# EAGLE design config (EAGLE 6.6.0)
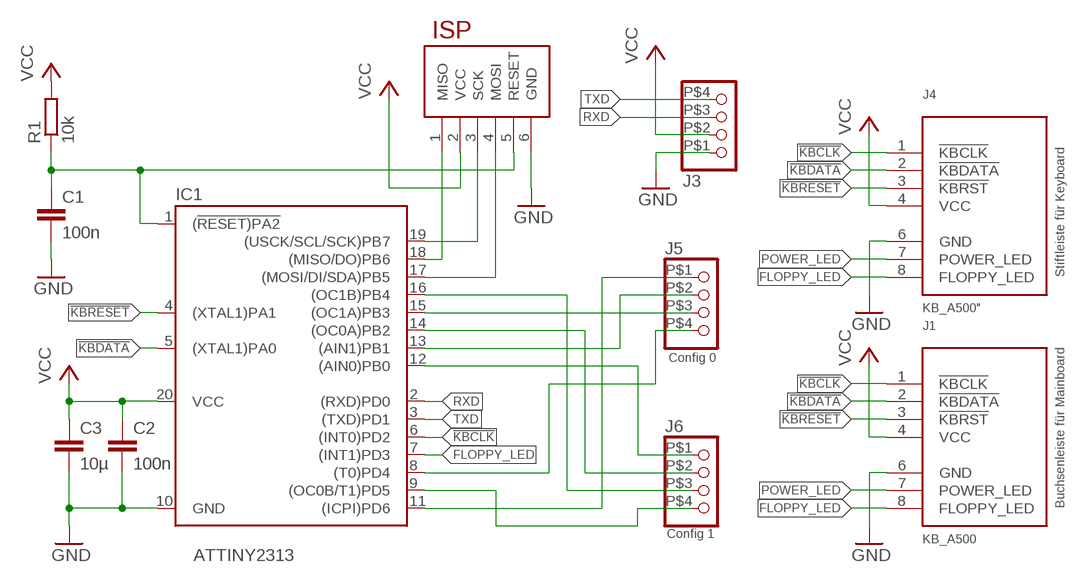
[diagram p0: schematic, sheet 1]

## Parts
C1  100n  C-EUC0805  [C0805]
C2  100n  C-EUC0805  [C0805]
C3  10µ  C-EUC1206  [C1206]
IC1  ATTINY2313  [SO20L]
J1  KB_A500  [1X08S]
J2  ISP  ISP6STEHEND  [2X03]
J3  PINHD-1X4  [1X04SLIM]
J4  KB_A500"  [1X08/90SLIM]
J5  PINHD-1X4  [1X04SLIM]
J6  PINHD-1X4  [1X04SLIM]
R1  10k  R-EU_R0805  [R0805]

## Nets
!KBCLK: IC1.6((INT0)PD2) J1.1(!KBCLK) J4.1(!KBCLK)
!KBDATA: IC1.5((XTAL1)PA0) J1.2(!KBDATA) J4.2(!KBDATA)
!KBRESET: IC1.4((XTAL1)PA1) J1.3(!KBRST) J4.3(!KBRST)
FLOPPY_LED: IC1.7((INT1)PD3) J1.8(FLOPPY_LED) J4.8(FLOPPY_LED)
GND: C1.2 C2.2 C3.2 IC1.10(GND) J1.6(GND) J2.6(GND) J3.P$1 J4.6(GND)
MISO: IC1.18((MISO/DO)PB6) J2.1(MISO)
MOSI: IC1.17((MOSI/DI/SDA)PB5) J2.4(MOSI)
N$1: IC1.12((AIN0)PB0) J6.P$1
N$2: IC1.9((OC0B/T1)PD5) J6.P$4
N$4: C1.1 IC1.1((!RESET)PA2) J2.5(RESET) R1.1
PB1: IC1.13((AIN1)PB1) J5.P$2
PB2: IC1.14((OC0A)PB2) J6.P$2
PB3: IC1.15((OC1A)PB3) J5.P$3
PB4: IC1.16((OC1B)PB4) J6.P$3
PD4: IC1.8((T0)PD4) J5.P$4
PD6: IC1.11((ICPI)PD6) J5.P$1
POWER_LED: J1.7(POWER_LED) J4.7(POWER_LED)
RXD: IC1.2((RXD)PD0) J3.P$3
SCK: IC1.19((USCK/SCL/SCK)PB7) J2.3(SCK)
TXD: IC1.3((TXD)PD1) J3.P$4
VCC: C2.1 C3.1 IC1.20(VCC) J1.4(VCC) J2.2(VCC) J3.P$2 J4.4(VCC) R1.2

## Notes on the sheet
- Stiftleiste für Keyboard
- Config 0
- Buchsenleiste für Mainboard
- Config 1

## Library data of the parts
C1-C3 = rcl:C-EU: CAPACITOR, European symbol
IC1 = 00-own-parts:ATTINY2313
J1 J4 = Amiga:KB_A500
J2 = 01-own-parts:ISP6
J3 J5 J6 = pinhead-1:PINHD-1X4: PIN HEADER
R1 = rcl:R-EU_: RESISTOR, European symbol

## Board
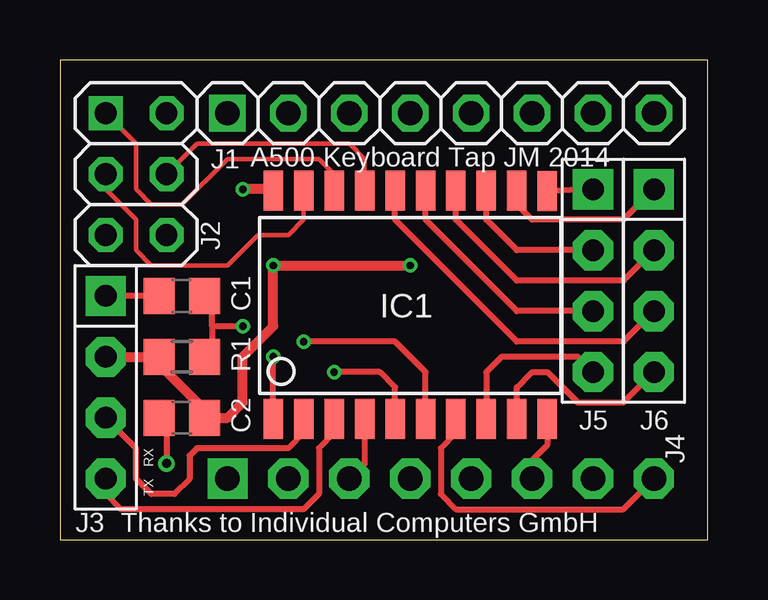
[diagram p1: board, top side]
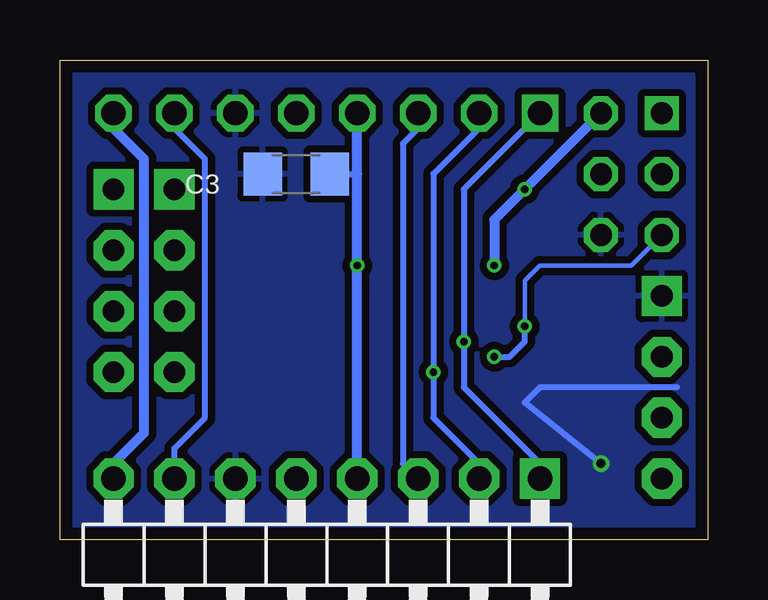
[diagram p2: board, bottom side, seen from below]

Size 27 x 20 mm. Coordinates in mm from the lower left corner, seen from the top.
Outline: 0,0 27,0 27,20 0,20 0,0
Copper layers (1*16): Top 0.035mm / dielectric 1.5mm / Bottom 0.035mm
Design rules "EagleRules": minimum track width 7mil, minimum drill 12mil, track to track 7mil, track to pad 7mil, pad to pad 7mil, via to via 7mil, smd to smd 0mil, copper to edge 20mil, drill to drill 10mil, minimum pad ring 10mil, minimum via ring 6mil, stop-mask expansion 2mil, vias tented up to drill 25mil, thermal gap 10mil

### Footprints (pad centres in the part's own frame; a part is rotated, then mirrored left to right if it is on the bottom)
C0805 = smd 1.3 x 1.5: 1 -0.95,0; 2 0.95,0
C1206 = smd 1.6 x 1.8: 1 -1.4,0; 2 1.4,0
SO20L = smd 0.813 x 1.676: 1 -5.08,-5.131; 2 -3.81,-5.131; 3 -2.54,-5.131; 4 -1.27,-5.131; 5 0,-5.131; 6 1.27,-5.131; 7 2.54,-5.131; 8 3.81,-5.131; 9 5.08,-5.131; 10 6.35,-5.131; 11 6.35,4.369; 12 5.08,4.394; 13 3.81,4.394; 14 2.54,4.394; 15 1.27,4.394; 16 0,4.394; 17 -1.27,4.394; 18 -2.54,4.394; 19 -3.81,4.394; 20 -5.08,4.394
1X08S = drill 1.016 square: 1 -7.62,0 | drill 1.016 octagon: 2 -5.08,0; 3 -2.54,0; 4 0,0; 5 2.54,0; 6 5.08,0; 7 7.62,0; 8 10.16,0
2X03 = drill 0.9 pad 1.422 square: 1 -2.54,-1.27 | drill 0.9 pad 1.422 octagon: 2 -2.54,1.27; 3 0,-1.27; 4 0,1.27; 5 2.54,-1.27; 6 2.54,1.27
1X04SLIM = drill 0.9 pad 1.676 square: P$1 0,0 | drill 0.9 pad 1.676 octagon: P$2 2.54,0; P$3 5.08,0; P$4 7.62,0
1X08/90SLIM = drill 1.016 pad 1.676 square: 1 -8.89,-2.54 | drill 1.016 pad 1.676 octagon: 2 -6.35,-2.54; 3 -3.81,-2.54; 4 -1.27,-2.54; 5 1.27,-2.54; 6 3.81,-2.54; 7 6.35,-2.54; 8 8.89,-2.54
R0805 = smd 1.3 x 1.5: 1 -0.95,0; 2 0.95,0

### Placement (x,y rotation side)
C1  5.08,10.16 180 top
C2  5.08,5.08 180 top
C3  17.14,15.24 180 bottom
IC1  13.97,10.16 0 top
J1  14.61,17.78 0 top
J2  3.17,15.24 270 top
J3  1.91,10.16 270 top
J4  15.88,0 180 bottom
J5  22.23,14.61 270 top
J6  24.77,14.61 270 top
R1  5.08,7.62 180 top

### Tracks (layer width: path | path; a pad name or v marks a point on that pad's centre or on a via)
!KBCLK  (via drill 0.3)
  Top 0.254: v10.16,8.26 13.97,8.26 15.24,6.99 IC1.6
  Bottom 0.254: J1.1 10.16,14.61 v10.16,8.26 10.16,6.35 6.99,3.17 J4.1
!KBDATA  (via drill 0.3)
  Top 0.254: v11.43,6.99 13.34,6.99 13.97,6.35 IC1.5
  Bottom 0.254: J1.2 9.53,17.14 11.43,15.24 v11.43,6.99 11.43,5.08 9.53,3.17 J4.2
!KBRESET
  Top 0.254: IC1.4 12.7,3.17 J4.3
  Bottom 0.254: J1.3 12.06,17.14 12.7,16.51 12.7,3.17 J4.3
FLOPPY_LED
  Top 0.254: IC1.7 16.51,4.45 15.88,3.81 15.88,1.91 16.51,1.27 23.5,1.27 J4.8
  Bottom 0.406: J4.8 24.77,3.17 23.5,4.45 23.5,15.88 24.77,17.14 J1.8
GND  (via drill 0.38)
  Top 0.254: C1.2 J3.P$1 | C2.2 4.45,5.08 v4.45,3.17 | IC1.10 20.32,3.95 19.7,3.33 19.7,2.56 J4.6
  Bottom 0.254: J3.P$1 1.27,10.16 | 1.27,6.35 6.99,6.35 7.62,5.71 v4.45,3.17
  pour Bottom (isolate 0.305): 0,0.64 0.64,19.68 26.67,19.68 26.67,0.64
MISO
  Top 0.178: IC1.18 11.43,15.24 10.79,15.88 6.99,15.88 5.08,13.97 3.81,13.97 3.17,14.61 3.17,16.51 J2.1
MOSI
  Top 0.178: IC1.17 12.7,15.88 12.06,16.51 5.71,16.51 J2.4
N$1
  Top 0.254: J6.P$1 23.5,13.34 19.68,13.34 19.05,13.97 IC1.12
N$2
  Top 0.254: IC1.9 19.05,6.35 19.68,6.99 20.32,6.99 21.59,5.71 23.5,5.71 J6.P$4
N$4  (via drill 0.3)
  Top 0.254: v7.62,8.89 6.35,8.89 | 6.35,8.89 6.35,10.16 C1.1 | 6.35,8.89 6.35,7.94 | 6.35,7.94 R1.1 | 6.35,7.94 6.35,7.62 | IC1.1 v8.89,7.62
  Bottom 0.178: v7.62,8.89 7.62,10.79 6.99,11.43 3.17,11.43 J2.5
  Bottom 0.254: v8.89,7.62 8.26,7.62 7.62,8.26 v7.62,8.89
PB1
  Top 0.254: J5.P$2 19.05,12.06 17.78,13.34 IC1.13
PB2
  Top 0.254: J6.P$2 23.5,10.79 19.05,10.79 16.51,13.34 IC1.14
PB3
  Top 0.254: J5.P$3 19.05,9.53 15.24,13.34 IC1.15
PB4
  Top 0.254: J6.P$3 23.5,8.26 19.05,8.26 13.97,13.34 IC1.16
PD4
  Top 0.254: J5.P$4 21.59,7.62 18.41,7.62 17.78,6.99 IC1.8
PD6
  Top 0.254: IC1.11 21.59,14.61 J5.P$1
POWER_LED
  Bottom 0.254: J4.7 22.23,3.81 20.95,5.08 20.95,15.88 22.23,17.14 J1.7
RXD
  Top 0.254: IC1.2 10.16,4.45 9.53,3.81 5.71,3.81 5.4,3.49 5.4,2.54 4.76,1.91 3.81,1.91 3.17,2.54 3.17,3.81 J3.P$3
SCK
  Top 0.178: IC1.19 10.16,13.34 9.53,12.7 8.26,12.7 6.99,11.43 3.81,11.43 3.17,12.06 3.17,13.34 1.91,14.61 J2.3
TXD
  Top 0.254: IC1.3 11.43,4.45 10.79,3.81 10.79,1.91 10.16,1.27 2.54,1.27 1.91,1.91 J3.P$4
VCC  (via drill 0.3)
  Top 0.254: IC1.20 8.89,14.61 | R1.2 4.13,7.3 | 5.71,5.71 6.35,5.4 | 6.35,5.4 C2.1 | 6.35,5.4 6.35,5.08
  Top 0.406: J3.P$2 R1.2 | 8.89,14.61 v7.62,14.61 | v14.61,11.43 v8.89,11.43 8.89,8.89 7.62,7.62 7.62,5.71 6.99,5.08 6.35,5.08 | 4.13,7.3 5.71,5.71
  Bottom 0.254: C3.1 14.61,15.24
  Bottom 0.406: J1.4 14.61,15.24 v14.61,11.43 J4.4 | v8.89,11.43 8.89,13.34 v7.62,14.61 J2.2

### Text on the board
tPlace: A500 Keyboard Tap JM 2014 | RX | TX | Thanks to Individual Computers GmbH